# EAGLE design BANTI (EAGLE 9.6.1)
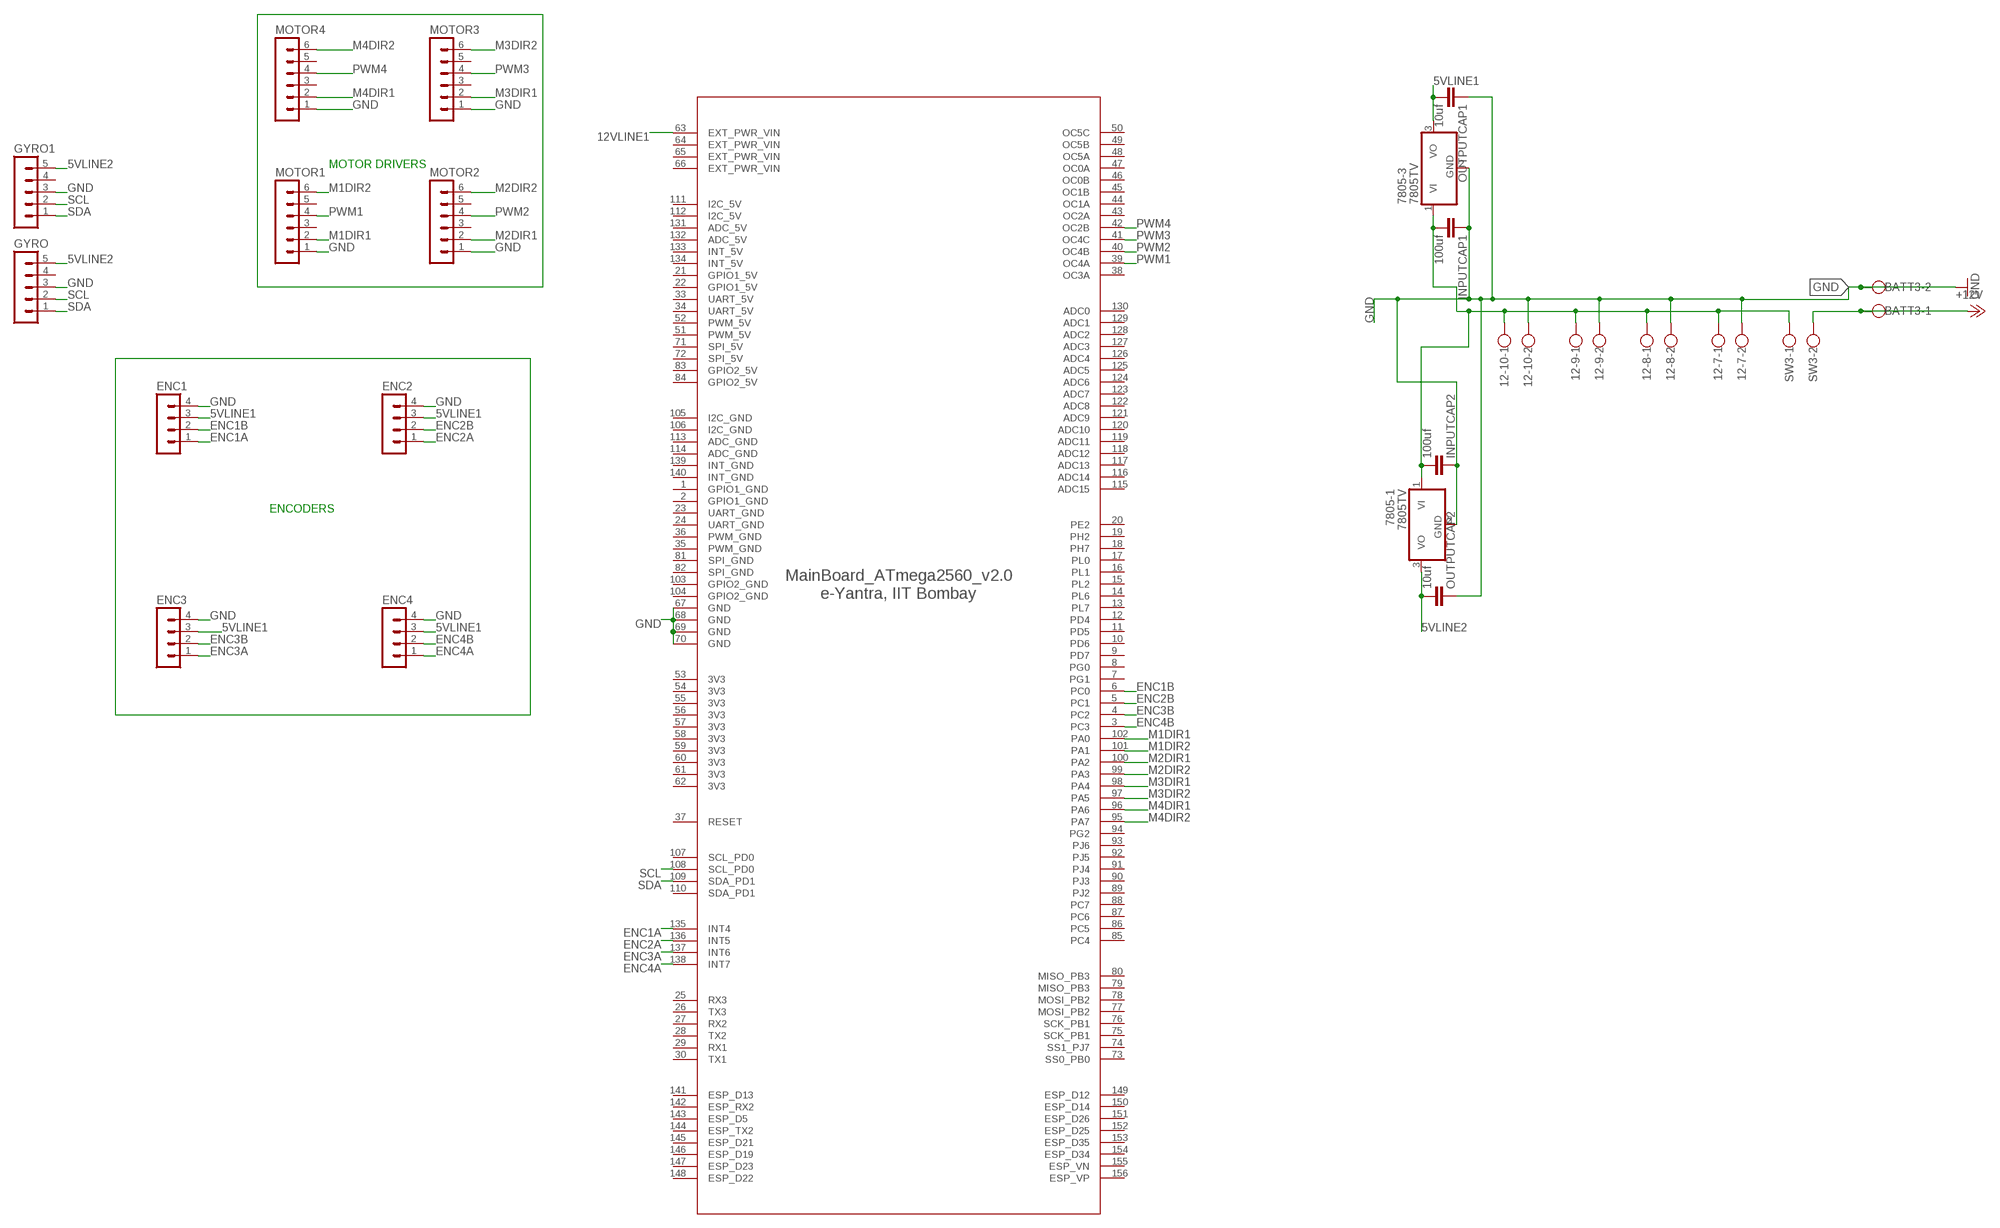
[diagram p0: schematic, sheet 1]

## Parts
12-7  W237-102  [W237-102]
12-8  W237-102  [W237-102]
12-9  W237-102  [W237-102]
12-10  W237-102  [W237-102]
7805-1  7805TV  [TO220V]
7805-3  7805TV  [TO220V]
BATT3  W237-102  [W237-102]
ENC1  MA04-1  [MA04-1]
ENC2  MA04-1  [MA04-1]
ENC3  MA04-1  [MA04-1]
ENC4  MA04-1  [MA04-1]
EYFI  ATMEGA2560_V2.0  [ATMEGA2560_V2.0]
GYRO  MA05-1  [MA05-1]
GYRO1  MA05-1  [MA05-1]
INPUTCAP1  100uf  C2.5/2  [C2.5-2]
INPUTCAP2  100uf  C2.5/2  [C2.5-2]
MOTOR1  MA06-1  [MA06-1]
MOTOR2  MA06-1  [MA06-1]
MOTOR3  MA06-1  [MA06-1]
MOTOR4  MA06-1  [MA06-1]
OUTPUTCAP1  10uf  C2.5/2  [C2.5-2]
OUTPUTCAP2  10uf  C2.5/2  [C2.5-2]
SW3  W237-102  [W237-102]

## Nets
5VLINE1: 7805-3.3(VO) ENC1.3 ENC2.3 ENC3.3 ENC4.3 OUTPUTCAP1.2
5VLINE2: 7805-1.3(VO) GYRO1.5 GYRO.5 OUTPUTCAP2.2
12VLINE1 [twelvevolt]: 12-7.1 12-8.1 12-9.1 12-10.1 7805-1.1(VI) 7805-3.1(VI) EYFI.63(EXT_PWR_VIN) INPUTCAP1.2 INPUTCAP2.2 SW3.1
+12V: BATT3.1 SW3.2
ENC1A: ENC1.1 EYFI.135(INT4)
ENC1B: ENC1.2 EYFI.6(PC0)
ENC2A: ENC2.1 EYFI.136(INT5)
ENC2B: ENC2.2 EYFI.5(PC1)
ENC3A: ENC3.1 EYFI.137(INT6)
ENC3B: ENC3.2 EYFI.4(PC2)
ENC4A: ENC4.1 EYFI.138(INT7)
ENC4B: ENC4.2 EYFI.3(PC3)
GND: 12-7.2 12-8.2 12-9.2 12-10.2 7805-1.2(GND) 7805-3.2(GND) BATT3.2 ENC1.4 ENC2.4 ENC3.4 ENC4.4 EYFI.67(GND) EYFI.68(GND) EYFI.69(GND) EYFI.70(GND) GYRO1.3 GYRO.3 INPUTCAP1.1 INPUTCAP2.1 MOTOR1.1 MOTOR2.1 MOTOR3.1 MOTOR4.1 OUTPUTCAP1.1 OUTPUTCAP2.1
M1DIR1: EYFI.102(PA0) MOTOR1.2
M1DIR2: EYFI.101(PA1) MOTOR1.6
M2DIR1: EYFI.100(PA2) MOTOR2.2
M2DIR2: EYFI.99(PA3) MOTOR2.6
M3DIR1: EYFI.98(PA4) MOTOR3.2
M3DIR2: EYFI.97(PA5) MOTOR3.6
M4DIR1: EYFI.96(PA6) MOTOR4.2
M4DIR2: EYFI.95(PA7) MOTOR4.6
PWM1: EYFI.39(OC4A) MOTOR1.4
PWM2: EYFI.40(OC4B) MOTOR2.4
PWM3: EYFI.41(OC4C) MOTOR3.4
PWM4: EYFI.42(OC2B) MOTOR4.4
SCL: EYFI.108(SCL_PD0) GYRO1.2 GYRO.2
SDA: EYFI.109(SDA_PD1) GYRO1.1 GYRO.1
Unconnected: EYFI.7(PG1) EYFI.8(PG0) EYFI.9(PD7) EYFI.10(PD6) EYFI.11(PD5) EYFI.12(PD4) EYFI.13(PL7) EYFI.14(PL6) EYFI.15(PL2) EYFI.16(PL1) EYFI.17(PL0) EYFI.18(PH7) EYFI.19(PH2) EYFI.20(PE2) EYFI.25(RX3) EYFI.26(TX3) EYFI.27(RX2) EYFI.28(TX2) EYFI.29(RX1) EYFI.30(TX1) EYFI.37(RESET) EYFI.38(OC3A) EYFI.43(OC2A) EYFI.44(OC1A) EYFI.45(OC1B) EYFI.46(OC0B) EYFI.47(OC0A) EYFI.48(OC5A) EYFI.49(OC5B) EYFI.50(OC5C) EYFI.73(SS0_PB0) EYFI.74(SS1_PJ7) EYFI.75(SCK_PB1) EYFI.76(SCK_PB1) EYFI.77(MOSI_PB2) EYFI.78(MOSI_PB2) EYFI.79(MISO_PB3) EYFI.80(MISO_PB3) EYFI.85(PC4) EYFI.86(PC5) EYFI.87(PC6) EYFI.88(PC7) EYFI.89(PJ2) EYFI.90(PJ3) EYFI.91(PJ4) EYFI.92(PJ5) EYFI.93(PJ6) EYFI.94(PG2) EYFI.107(SCL_PD0) EYFI.110(SDA_PD1) EYFI.115(ADC15) EYFI.116(ADC14) EYFI.117(ADC13) EYFI.118(ADC12) EYFI.119(ADC11) EYFI.120(ADC10) EYFI.121(ADC9) EYFI.122(ADC8) EYFI.123(ADC7) EYFI.124(ADC6) EYFI.125(ADC5) EYFI.126(ADC4) EYFI.127(ADC3) EYFI.128(ADC2) EYFI.129(ADC1) EYFI.130(ADC0) EYFI.141(ESP_D13) EYFI.142(ESP_RX2) EYFI.143(ESP_D5) EYFI.144(ESP_TX2) EYFI.145(ESP_D21) EYFI.146(ESP_D19) EYFI.147(ESP_D23) EYFI.148(ESP_D22) EYFI.149(ESP_D12) EYFI.150(ESP_D14) EYFI.151(ESP_D26) EYFI.152(ESP_D25) EYFI.153(ESP_D35) EYFI.154(ESP_D34) EYFI.155(ESP_VN) EYFI.156(ESP_VP) GYRO1.4 GYRO.4 MOTOR1.3 MOTOR1.5 MOTOR2.3 MOTOR2.5 MOTOR3.3 MOTOR3.5 MOTOR4.3 MOTOR4.5

## Notes on the sheet
- MOTOR DRIVERS
- ENCODERS

## Power pins joined to a net without a drawn wire
3V3: EYFI.53(3V3) EYFI.54(3V3) EYFI.55(3V3) EYFI.56(3V3) EYFI.57(3V3) EYFI.58(3V3) EYFI.59(3V3) EYFI.60(3V3) EYFI.61(3V3) EYFI.62(3V3)
ADC_5V: EYFI.131(ADC_5V) EYFI.132(ADC_5V)
ADC_GND: EYFI.113(ADC_GND) EYFI.114(ADC_GND)
EXT_PWR_VIN: EYFI.64(EXT_PWR_VIN) EYFI.65(EXT_PWR_VIN) EYFI.66(EXT_PWR_VIN)
GPIO1_5V: EYFI.21(GPIO1_5V) EYFI.22(GPIO1_5V)
GPIO1_GND: EYFI.1(GPIO1_GND) EYFI.2(GPIO1_GND)
GPIO2_5V: EYFI.83(GPIO2_5V) EYFI.84(GPIO2_5V)
GPIO2_GND: EYFI.103(GPIO2_GND) EYFI.104(GPIO2_GND)
I2C_5V: EYFI.111(I2C_5V) EYFI.112(I2C_5V)
I2C_GND: EYFI.105(I2C_GND) EYFI.106(I2C_GND)
INT_5V: EYFI.133(INT_5V) EYFI.134(INT_5V)
INT_GND: EYFI.139(INT_GND) EYFI.140(INT_GND)
PWM_5V: EYFI.51(PWM_5V) EYFI.52(PWM_5V)
PWM_GND: EYFI.35(PWM_GND) EYFI.36(PWM_GND)
SPI_5V: EYFI.71(SPI_5V) EYFI.72(SPI_5V)
SPI_GND: EYFI.81(SPI_GND) EYFI.82(SPI_GND)
UART_5V: EYFI.33(UART_5V) EYFI.34(UART_5V)
UART_GND: EYFI.23(UART_GND) EYFI.24(UART_GND)

## Library data of the parts
12-7-12-10 BATT3 SW3 = con-wago-500:W237-102: WAGO SCREW CLAMP; MPN: 237-102; OC_FARNELL: unknown; OC_NEWARK: 70K9898
7805-1 7805-3 = linear:78*: Positive VOLTAGE REGULATOR Source: http://cache.national.com/ds/LM/LM78L05.pdf http://www.fairchildsemi.com/ds/LM/LM7805.pdf
ENC1-ENC4 = con-lstb:MA04-1: PIN HEADER; OC_FARNELL: unknown; OC_NEWARK: unknown
EYFI = eYFi-Mega_v2.0.1:ATMEGA2560_V2.0
GYRO GYRO1 = con-lstb:MA05-1: PIN HEADER; OC_FARNELL: unknown; OC_NEWARK: unknown
INPUTCAP1 INPUTCAP2 OUTPUTCAP1 OUTPUTCAP2 = capacitor-wima:C: CAPACITOR naming: grid - package width
MOTOR1-MOTOR4 = con-lstb:MA06-1: PIN HEADER; OC_FARNELL: unknown; OC_NEWARK: unknown

## Net classes
0 default: width 0.7 mm, drill 0.508 mm, clearance 0.254 mm
1 New Class: width 1 mm, drill 0.508 mm, clearance 0.254 mm
2 twelvevolt: width 2 mm, drill 0.508 mm, clearance 0.254 mm

## Board
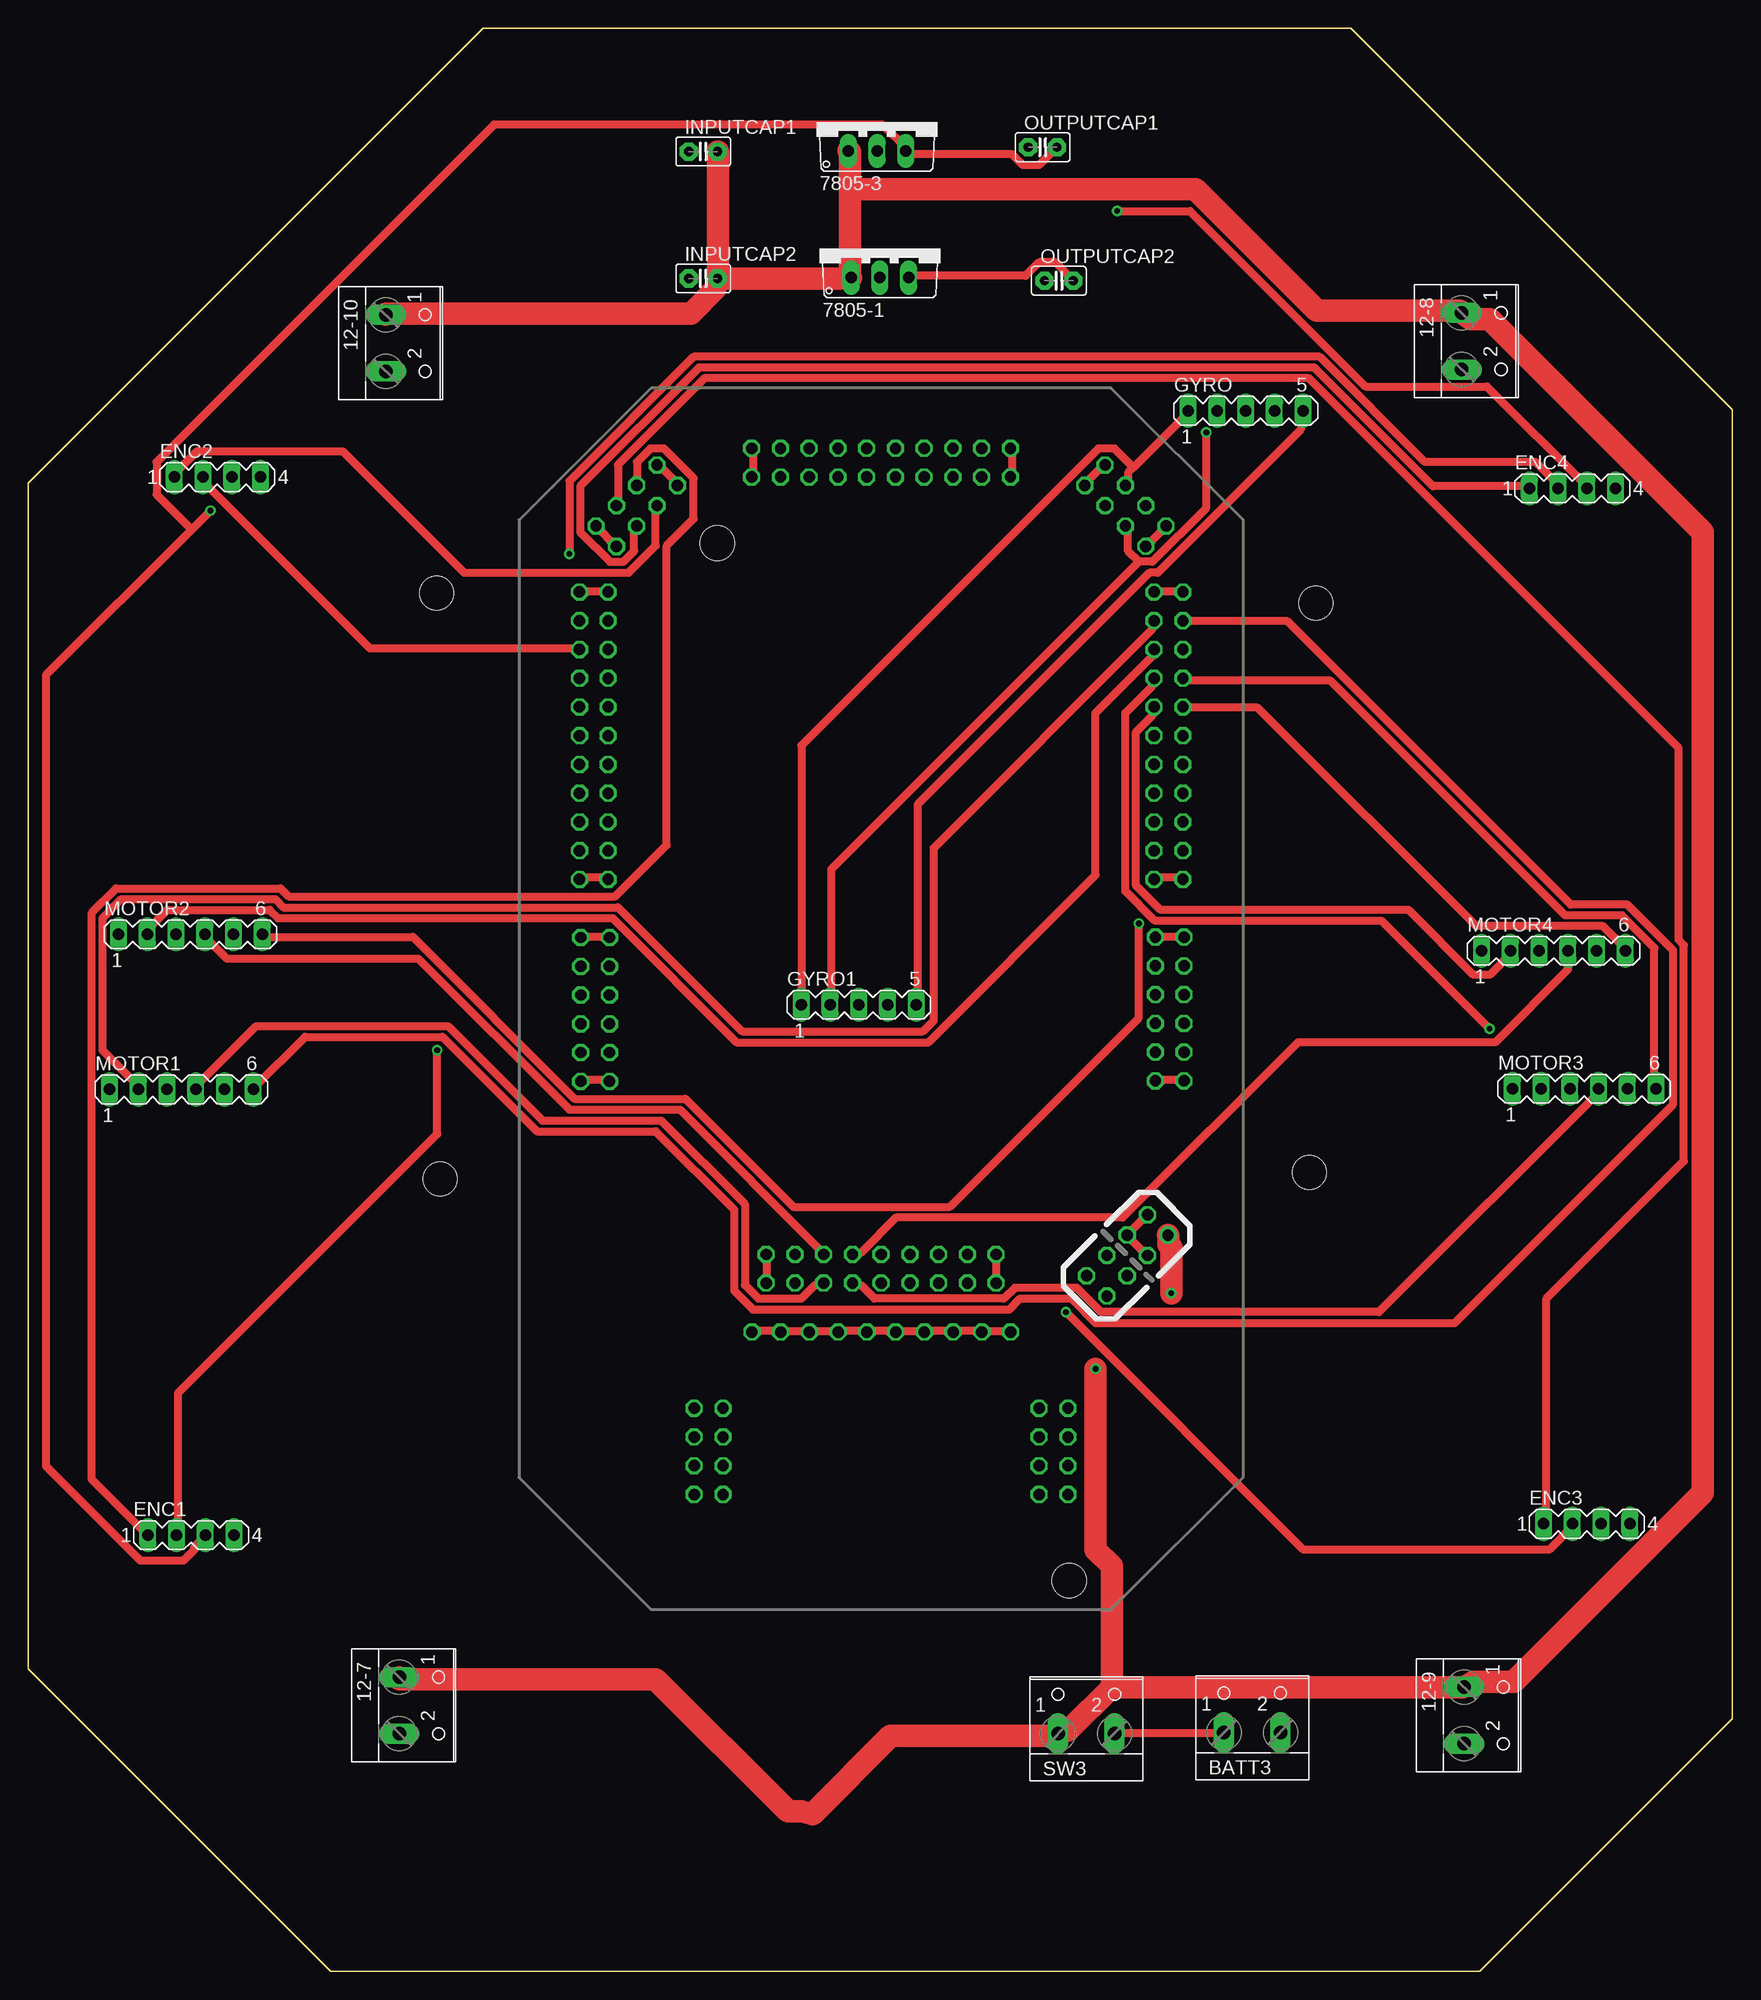
[diagram p1: board, top side]
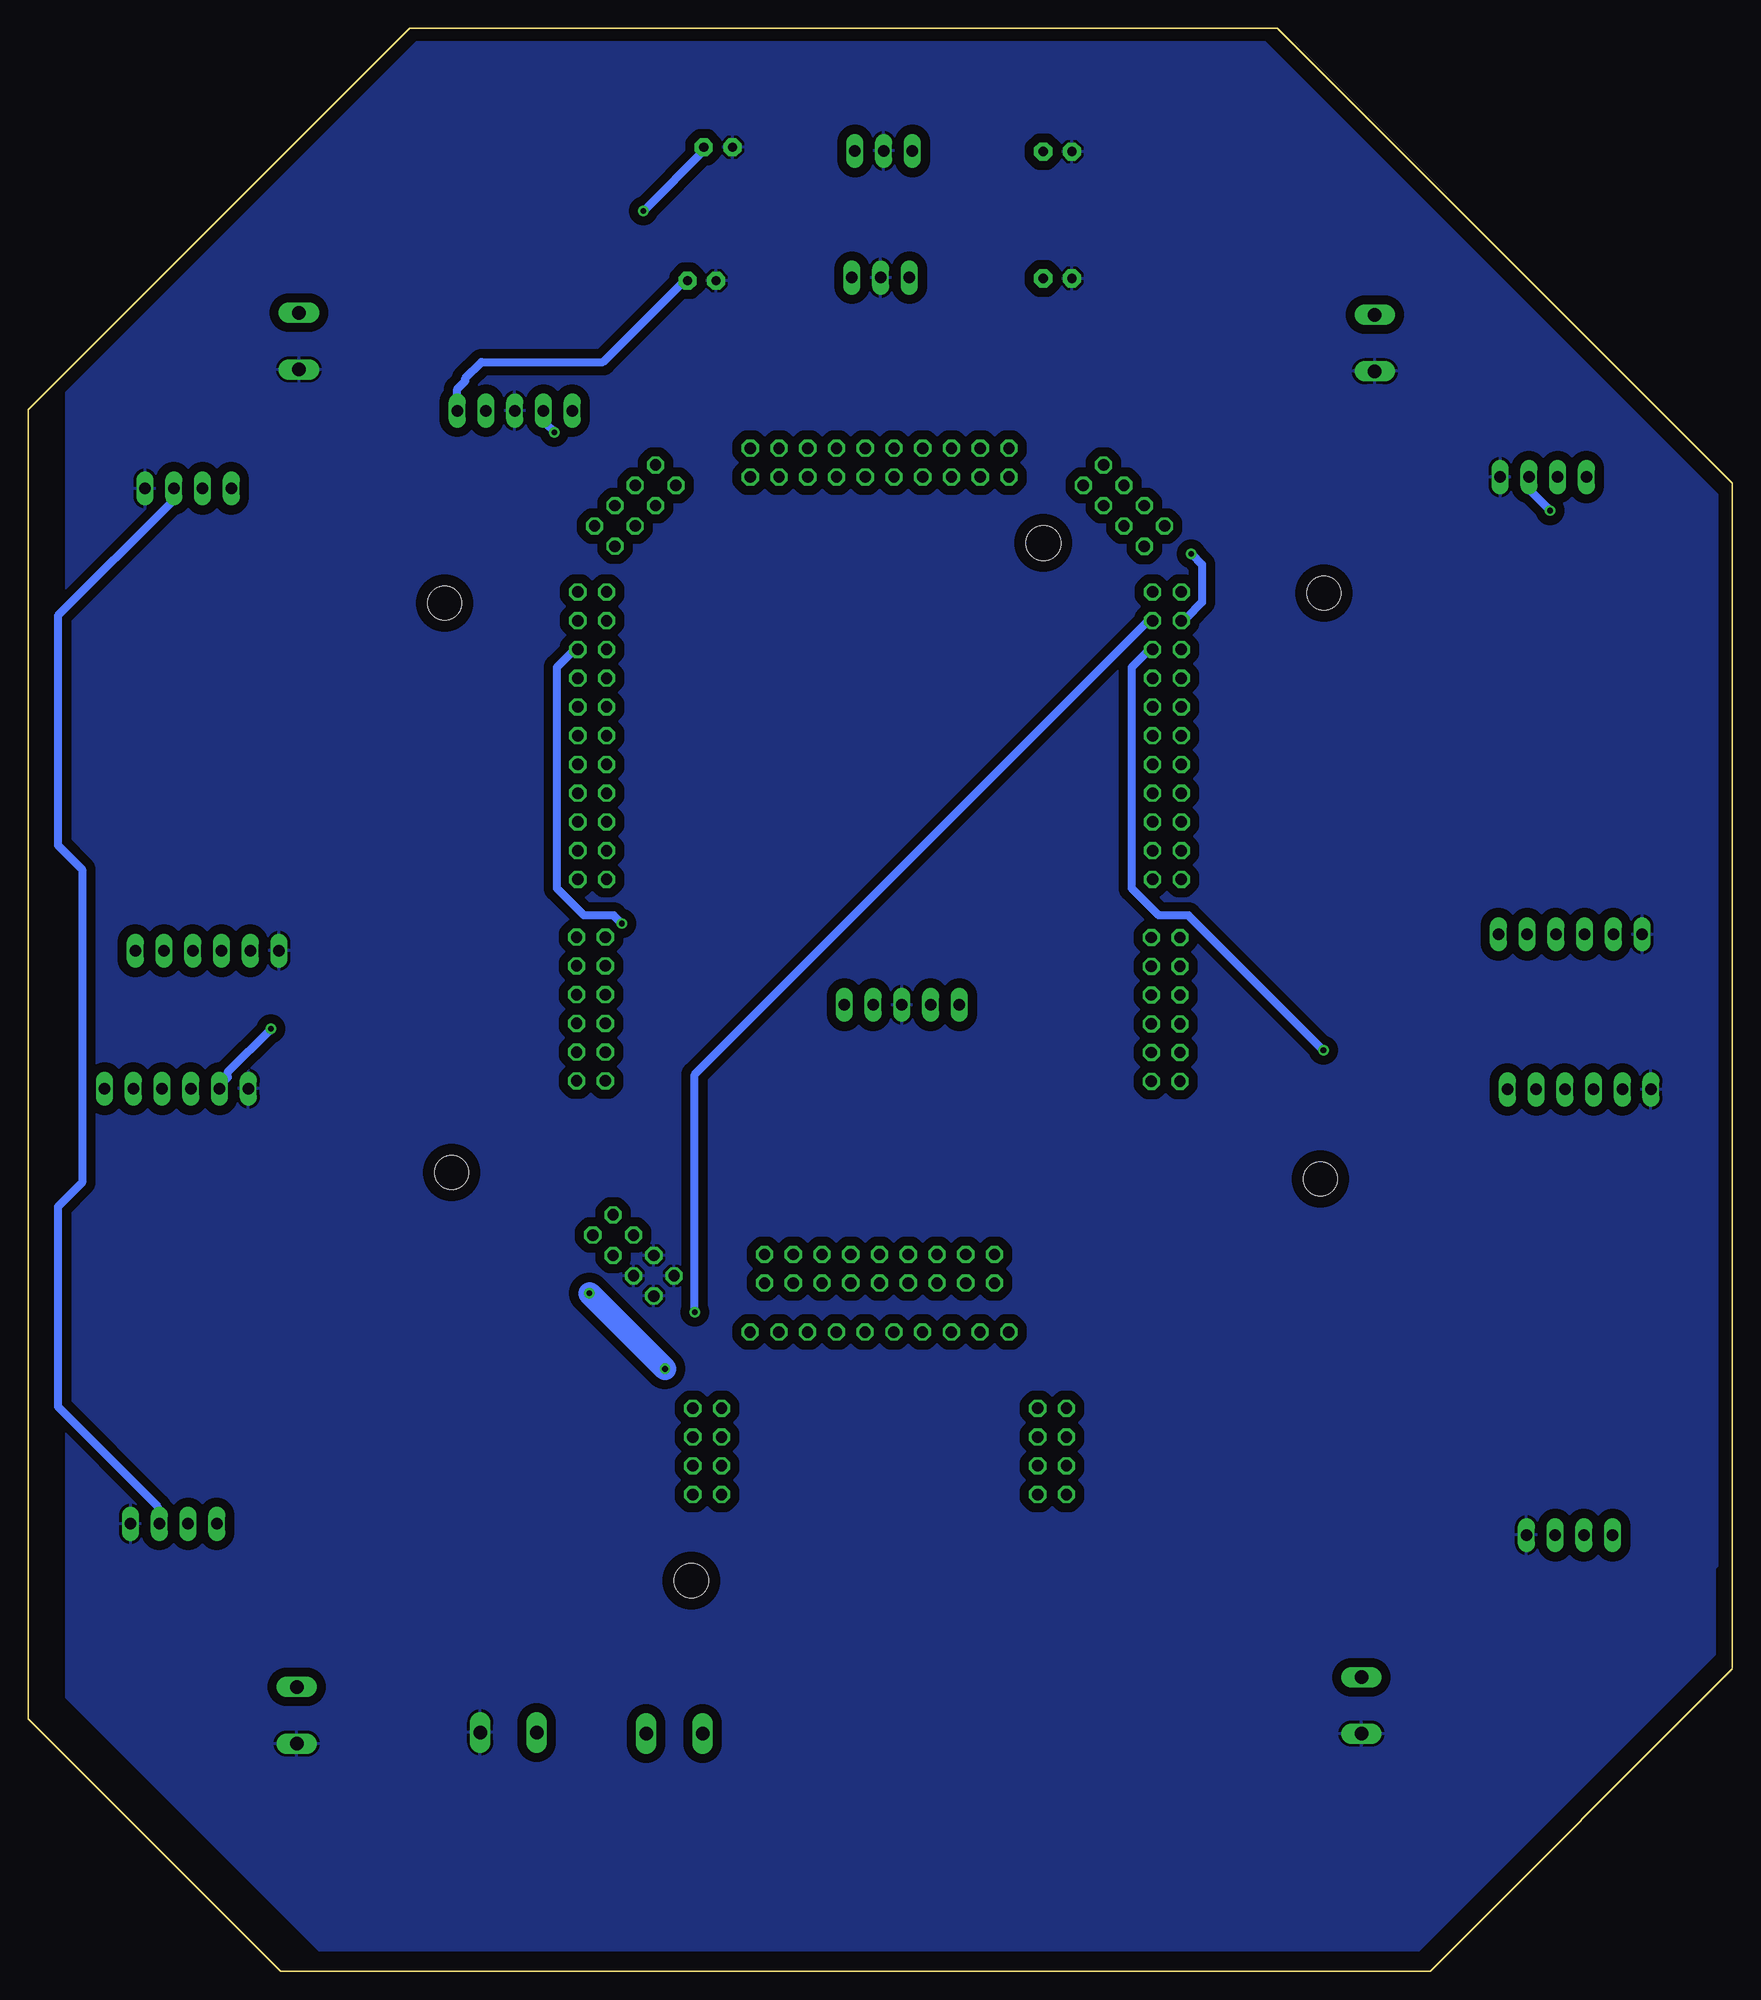
[diagram p2: board, bottom side, seen from below]

Size 150.6 x 171.7 mm. Coordinates in mm from the lower left corner, seen from the top.
Outline: 0,26.8 0,131.5 40.2,171.7 116.9,171.7 150.6,138 150.6,22.3 128.3,0 26.7,0 0,26.7
Copper layers (1*16): Top 0.035mm / dielectric 1.5mm / Bottom 0.035mm
Design rules "default": minimum track width 6mil, minimum drill 0.35mm, track to track 6mil, track to pad 6mil, pad to pad 6mil, via to via 6mil, smd to smd 6mil, copper to edge 40mil, drill to drill 6mil, minimum pad ring 10mil, minimum via ring 8mil, stop-mask expansion 4mil, vias tented up to drill 0mil, thermal gap 10mil
Holes 3 mm at 36.1,121.8 36.4,70 113.2,70.6 113.8,120.9

### Footprints (pad centres in the part's own frame; a part is rotated, then mirrored left to right if it is on the bottom)
W237-102 = drill 1.194 long: 1 -2.5,-1.27; 2 2.5,-1.27
TO220V = drill 1.016 long: 1 -2.54,-2.54; 2 0,-2.54; 3 2.54,-2.54
MA04-1 = drill 1.016 long: 1 -3.81,0; 2 -1.27,0; 3 1.27,0; 4 3.81,0
ATMEGA2560_V2.0 = drill 1 octagon: 1 5.344,89.916; 2 7.884,89.916; 3 5.344,87.376; 4 7.884,87.376; 5 5.344,84.836; 6 7.884,84.836; 7 5.344,82.296; 8 7.884,82.296; 9 5.344,79.756; 10 7.884,79.756; 11 5.344,77.216; 12 7.884,77.216; 13 5.344,74.676; 14 7.884,74.676; 15 5.344,72.136; 16 7.884,72.136; 17 5.344,69.596; 18 7.884,69.596; 19 5.344,67.056; 20 7.884,67.056; 21 5.344,64.516; 22 7.884,64.516; 23 5.461,59.373; 24 8.001,59.373; 25 5.461,56.833; 26 8.001,56.833; 27 5.461,54.292; 28 8.001,54.292; 29 5.461,51.752; 30 8.001,51.752; 31 5.461,49.212; 32 8.001,49.212; 33 5.461,46.672; 34 8.001,46.672; 35 21.857,28.839; 36 21.857,31.379; 37 24.397,28.839; 38 24.397,31.379; 39 26.937,28.839; 40 26.937,31.379; 41 29.477,28.839; 42 29.477,31.379; 43 32.017,28.839; 44 32.017,31.379; 45 34.557,28.839; 46 34.557,31.379; 47 37.097,28.839; 48 37.097,31.379; 49 39.637,28.839; 50 39.637,31.379; 51 42.177,28.839; 52 42.177,31.379; 53 20.592,24.511; 54 23.132,24.511; 55 25.672,24.511; 56 28.212,24.511; 57 30.752,24.511; 58 33.292,24.511; 59 35.832,24.511; 60 38.372,24.511; 61 40.912,24.511; 62 43.452,24.511; 63 57.348,33.078; 64 55.552,34.874; 65 55.552,31.282; 66 53.756,33.078; 67 53.756,29.486; 68 51.96,31.282; 69 51.96,27.69; 70 50.164,29.486; 71 58.783,46.711; 72 56.243,46.711; 73 58.783,49.251; 74 56.243,49.251; 75 58.783,51.791; 76 56.243,51.791; 77 58.783,54.331; 78 56.243,54.331; 79 58.783,56.871; 80 56.243,56.871; 81 58.783,59.411; 82 56.243,59.411; 83 58.674,64.516; 84 56.134,64.516; 85 58.674,67.056; 86 56.134,67.056; 87 58.674,69.596; 88 56.134,69.596; 89 58.674,72.136; 90 56.134,72.136; 91 58.674,74.676; 92 56.134,74.676; 93 58.674,77.216; 94 56.134,77.216; 95 58.674,79.756; 96 56.134,79.756; 97 58.674,82.296; 98 56.134,82.296; 99 58.674,84.836; 100 56.134,84.836; 101 58.674,87.376; 102 56.134,87.376; 103 58.674,89.916; 104 56.134,89.916; 105 57.192,95.746; 106 55.396,93.95; 107 55.396,97.542; 108 53.6,95.746; 109 53.6,99.338; 110 51.804,97.542; 111 51.804,101.135; 112 50.008,99.338; 113 43.434,102.616; 114 43.434,100.076; 115 40.894,102.616; 116 40.894,100.076; 117 38.354,102.616; 118 38.354,100.076; 119 35.814,102.616; 120 35.814,100.076; 121 33.274,102.616; 122 33.274,100.076; 123 30.734,102.616; 124 30.734,100.076; 125 28.194,102.616; 126 28.194,100.076; 127 25.654,102.616; 128 25.654,100.076; 129 23.114,102.616; 130 23.114,100.076; 131 20.574,102.616; 132 20.574,100.076; 133 12.208,101.133; 134 14.004,99.337; 135 10.411,99.337; 136 12.208,97.541; 137 8.615,97.541; 138 10.411,95.745; 139 6.819,95.745; 140 8.615,93.949; 141 15.494,17.78; 142 18.034,17.78; 143 15.494,15.24; 144 18.034,15.24; 145 15.494,12.7; 146 18.034,12.7; 147 15.494,10.16; 148 18.034,10.16; 149 45.974,17.78; 150 48.514,17.78; 151 45.974,15.24; 152 48.514,15.24; 153 45.974,12.7; 154 48.514,12.7; 155 45.974,10.16; 156 48.514,10.16 | hole 3.048: 17.526,94.234; 48.641,2.54
MA05-1 = drill 1.016 long: 1 -5.08,0; 2 -2.54,0; 3 0,0; 4 2.54,0; 5 5.08,0
C2.5-2 = drill 0.813 pad 1.6 octagon: 1 -1.27,0; 2 1.27,0
MA06-1 = drill 1.016 long: 1 -6.35,0; 2 -3.81,0; 3 -1.27,0; 4 1.27,0; 5 3.81,0; 6 6.35,0

### Placement (x,y rotation side)
12-7  34.05,23.49 270 top
12-8  127.95,144.05 270 top
12-9  128.15,22.61 270 top
12-10  32.87,143.88 270 top
7805-1  75.27,152.21 0 top
7805-3  75.01,163.41 0 top
BATT3  108.16,22.37 0 top
ENC1  14.38,38.54 0 top
ENC2  16.71,132.04 0 top
ENC3  137.74,39.54 0 top
ENC4  136.47,131.04 0 top
EYFI  43.36,31.97 0 top
GYRO  107.6,137.9 0 top
GYRO1  73.4,85.4 0 top
INPUTCAP1  59.64,160.81 0 top
INPUTCAP2  59.64,149.59 0 top
MOTOR1  13.54,77.93 0 top
MOTOR2  14.33,91.63 0 top
MOTOR3  137.51,77.99 0 top
MOTOR4  134.8,90.19 0 top
OUTPUTCAP1  89.64,161.19 0 top
OUTPUTCAP2  91.08,149.39 0 top
SW3  93.5,22.27 0 top

### Tracks (layer width: path | path; a pad name or v marks a point on that pad's centre or on a via)
3V3
  Top 0.7: EYFI.53 64.04,56.57 66.43,56.57 EYFI.54 66.66,56.57 68.81,56.57 EYFI.55 69.29,56.57 71.44,56.57 EYFI.56 71.67,56.57 73.82,56.57 EYFI.57 74.3,56.57 76.44,56.57 EYFI.58 76.92,56.57 79.07,56.57 EYFI.59 79.31,56.57 81.45,56.57 EYFI.60 81.93,56.57 84.08,56.57 EYFI.61 84.55,56.57 86.7,56.57 EYFI.62
5VLINE1  (via drill 0.51)
  Top 0.7: v16.1,129.08 14.43,127.41 | 14.43,127.41 1.55,114.53 1.55,44.65 9.9,36.3 13.72,36.3 14.67,37.26 14.67,37.49 15.63,38.45 ENC1.3 | v96.24,155.55 102.68,155.55 118.18,140.05 128.91,140.05 137.74,131.22 ENC4.3 | 14.43,127.41 11.33,130.51 11.33,133.37 41.15,163.18 75.49,163.18 77.64,161.04 77.64,160.8 7805-3.3 77.87,160.56 86.94,160.56 87.89,159.61 89.32,159.61 90.75,161.04 OUTPUTCAP1.2
  Bottom 0.7: v16.1,129.08 17.77,130.75 17.77,131.94 ENC2.3 | v96.24,155.55 90.75,161.04 90.99,161.28 OUTPUTCAP1.2 | ENC3.3 139.17,39.64 139.17,41.07 147.99,49.9 147.99,67.55 145.85,69.69 145.85,97.36 147.99,99.5 147.99,119.78 137.98,129.79 137.98,130.99 ENC4.3
5VLINE2
  Top 0.7: 7805-1.3 77.87,149.83 88.13,149.83 89.32,151.02 90.75,151.02 92.18,149.59 OUTPUTCAP2.2 | GYRO.5 112.46,137.66 112.46,136.23 99.82,123.59 99.1,123.59 78.59,103.08 78.59,85.43 GYRO1.5
  Bottom 0.7: OUTPUTCAP2.2 92.42,149.35 92.66,149.35 99.82,142.2 110.55,142.2 111.98,140.77 111.98,140.53 112.69,139.81 112.69,137.9 GYRO.5
12VLINE1  (via drill 0.51)
  Top 2: 72.63,157.46 72.63,160.8 7805-3.1 | 72.63,157.46 72.63,149.83 | 72.63,149.83 7805-1.1 | 60.94,149.59 71.67,149.59 72.63,149.83 | 60.94,149.59 INPUTCAP2.2 | 60.94,149.59 60.94,160.8 INPUTCAP1.2 | 12-10.1 31.61,146.49 58.56,146.49 60.7,148.64 60.94,149.59 | 72.63,157.46 103.16,157.46 113.89,146.73 126.53,146.73 12-8.1 127.48,146.01 129.15,146.01 147.99,127.17 147.99,42.27 131.3,25.57 127.72,25.57 12-9.1 126.77,25.09 95.76,25.09 | 12-7.1 32.8,25.81 55.46,25.81 67.14,14.12 68.33,14.12 69.29,13.88 76.2,20.8 90.99,20.8 SW3.1 91.95,21.28 95.76,25.09 | v101.01,59.91 101.01,63.97 100.77,64.21 100.77,64.92 EYFI.63 | v94.33,53.24 94.33,37.26 95.76,35.83 95.76,25.09
  Bottom 2: v94.33,53.24 v101.01,59.91
+12V
  Top 0.7: SW3.2 96,21.04 105.54,21.04 BATT3.1
ADC_5V
  Top 0.7: EYFI.132 64.04,132.18 64.04,134.56 EYFI.131
ADC_GND
  Top 0.7: EYFI.114 86.94,132.18 86.94,134.56 EYFI.113
ENC1A
  Top 0.7: EYFI.135 53.79,131.46 53.79,133.37 54.98,134.56 56.17,134.56 58.79,131.94 58.79,128.36 56.41,125.98 56.41,99.5 51.88,94.97 23.02,94.97 22.3,95.69 7.76,95.69 5.61,93.54 5.61,43.46 10.38,38.69 ENC1.1
ENC1B  (via drill 0.51)
  Top 0.7: v36.14,81.38 36.14,73.99 13.24,51.09 13.24,38.69 ENC1.2
  Bottom 0.7: v36.14,81.38 48.06,93.3 50.69,93.3 53.07,95.69 53.07,115.25 51.64,116.68 51.4,116.68 EYFI.6
ENC2A
  Top 0.7: EYFI.136 55.46,129.32 55.46,125.98 53.07,123.59 38.52,123.59 27.79,134.33 14.91,134.33 12.76,132.18 ENC2.1
ENC2B
  Top 0.7: EYFI.5 48.54,116.91 30.17,116.91 15.63,131.46 15.63,131.94 ENC2.2
ENC3A
  Top 0.7: EYFI.137 52.12,129.56 52.12,133.13 59.75,140.77 113.17,140.77 145.85,108.09 145.85,91.16 146.32,90.68 146.32,71.6 134.16,59.44 134.16,39.64 ENC3.1
ENC3B  (via drill 0.51)
  Top 0.7: v91.71,58.24 112.69,37.26 134.4,37.26 136.55,39.4 ENC3.2
  Bottom 0.7: v91.71,58.24 91.71,79.23 51.64,119.3 51.4,119.3 EYFI.4
ENC4A
  Top 0.7: EYFI.138 53.55,127.65 53.55,125.5 52.59,124.55 51.4,124.55 48.78,127.17 48.78,131.22 59.27,141.72 113.65,141.72 124.14,131.22 132.49,131.22 ENC4.1
ENC4B  (via drill 0.51)
  Top 0.7: v47.82,125.26 47.82,131.7 58.79,142.67 114.13,142.67 123.43,133.37 133.21,133.37 135.35,131.22 ENC4.2
  Bottom 0.7: v47.82,125.26 46.87,124.31 46.87,120.97 48.3,119.54 48.54,119.54 EYFI.3
EXT_PWR_VIN
  Top 0.7: EYFI.65 98.86,63.25 97.19,64.92 EYFI.66 97.19,65.16 98.86,66.83 EYFI.64
GND
  pour Bottom (isolate 0.813): 1.3,35.8 1.3,130.5 41.4,170.6 116.2,170.6 147.3,139.5 147.3,24.2 126.9,3.8 124.9,1.8 27.7,1.8 1.5,28 1.5,35.3 1.5,35.6
GPIO1_5V
  Top 0.7: EYFI.21 48.78,96.64 51.16,96.64 EYFI.22
GPIO1_GND
  Top 0.7: EYFI.1 48.78,121.92 51.16,121.92 EYFI.2
GPIO2_5V
  Top 0.7: EYFI.84 99.58,96.64 101.96,96.64 EYFI.83
GPIO2_GND
  Top 0.7: EYFI.104 99.58,121.92 101.96,121.92 EYFI.103
I2C_5V
  Top 0.7: EYFI.112 93.38,131.46 95.05,133.13 EYFI.111
I2C_GND
  Top 0.7: EYFI.106 98.86,125.98 100.53,127.65 EYFI.105
INT_5V
  Top 0.7: EYFI.134 57.36,131.46 55.69,133.13 EYFI.133
INT_GND
  Top 0.7: EYFI.140 51.88,125.98 50.21,127.65 EYFI.139
M1DIR1
  Top 0.7: EYFI.102 99.34,119.3 99.34,118.59 80.02,99.27 80.02,84 79.07,83.05 63.09,83.05 52.12,94.02 22.54,94.02 21.83,94.74 8.23,94.74 6.56,93.07 6.56,81.38 9.9,78.04 MOTOR1.2
M1DIR2
  Top 0.7: EYFI.101 102.2,119.3 111.26,119.3 136.31,94.26 141.31,94.26 145.37,90.2 145.37,76.61 126.05,57.29 94.33,57.29 92.18,59.44 87.65,59.44 86.7,58.48 64.04,58.48 62.37,60.15 62.37,67.31 55.46,74.22 44.96,74.22 36.61,82.57 24.45,82.57 19.92,78.04 MOTOR1.6
M2DIR1
  Top 0.7: EYFI.100 99.34,116.68 99.34,116.2 94.33,111.19 94.33,96.88 79.54,82.09 62.61,82.09 51.64,93.07 22.07,93.07 21.35,93.78 12.29,93.78 10.62,92.11 10.62,91.63 MOTOR2.2
M2DIR2  (via drill 0.51)
  Top 0.7: v98.15,92.59 98.15,84.24 81.45,67.55 67.62,67.55 58.08,77.09 48.3,77.09 33.99,91.4 20.87,91.4 MOTOR2.6
  Bottom 0.7: v98.15,92.59 98.86,93.3 101.49,93.3 103.87,95.69 103.87,115.25 102.44,116.68 102.2,116.68 EYFI.99
M3DIR1  (via drill 0.51)
  Top 0.7: v129.15,83.29 119.61,92.83 99.58,92.83 96.95,95.45 96.95,111.19 99.34,113.58 99.34,114.05 EYFI.98
  Bottom 0.7: v129.15,83.29 132.97,79.47 132.97,78.99 133.92,78.04 MOTOR3.2
M3DIR2
  Top 0.7: EYFI.97 102.2,114.05 115.08,114.05 135.83,93.3 140.84,93.3 143.7,90.44 143.7,78.04 MOTOR3.6
M4DIR1
  Top 0.7: EYFI.96 99.34,111.67 99.34,110.95 97.91,109.52 97.91,95.93 100.06,93.78 122,93.78 127.72,88.06 129.15,88.06 131.06,89.97 MOTOR4.2
M4DIR2
  Top 0.7: EYFI.95 102.2,111.67 108.64,111.67 127.96,92.35 139.17,92.35 141.31,90.2 MOTOR4.6
PWM1
  Top 0.7: EYFI.39 70.24,60.63 69.53,60.63 68.33,59.44 64.52,59.44 63.33,60.63 63.33,67.78 55.93,75.18 45.44,75.18 37.09,83.53 20.16,83.53 14.67,78.04 MOTOR1.4
PWM2
  Top 0.7: EYFI.40 70.24,63.49 57.6,76.13 47.82,76.13 34.47,89.49 17.53,89.49 15.63,91.4 MOTOR2.4
PWM3
  Top 0.7: EYFI.41 72.87,60.63 73.58,60.63 74.77,59.44 86.22,59.44 87.18,60.39 92.66,60.39 94.81,58.24 119.37,58.24 138.93,77.8 MOTOR3.4
PWM4
  Top 0.7: EYFI.42 72.87,63.49 73.58,63.49 76.68,66.59 96.72,66.59 112.22,82.09 129.63,82.09 136.07,88.53 136.07,89.97 MOTOR4.4
PWM_5V
  Top 0.7: EYFI.51 85.51,60.87 85.51,63.25 EYFI.52
PWM_GND
  Top 0.7: EYFI.35 65.23,60.87 65.23,63.25 EYFI.36
SCL  (via drill 0.51)
  Top 0.7: 98.15,124.55 97.19,125.5 97.19,127.65 EYFI.108 | 98.15,124.55 99.34,124.55 104.11,129.32 v104.11,136 | 98.15,124.55 70.96,97.36 70.96,85.43 GYRO1.2
  Bottom 0.7: v104.11,136 104.82,136.71 104.82,137.66 GYRO.2
SDA
  Top 0.7: 97.67,132.89 102.44,137.66 GYRO.1 | 97.67,132.89 97.19,132.42 97.19,131.46 EYFI.109 | 97.67,132.89 96,134.56 94.57,134.56 68.33,108.33 68.33,85.43 GYRO1.1
SPI_5V
  Top 0.7: EYFI.72 99.82,78.76 101.96,78.76 EYFI.71
SPI_GND
  Top 0.7: EYFI.82 99.82,91.4 101.96,91.4 EYFI.81
UART_5V
  Top 0.7: EYFI.33 49.02,78.76 51.16,78.76 EYFI.34
UART_GND
  Top 0.7: EYFI.23 49.02,91.4 51.16,91.4 EYFI.24